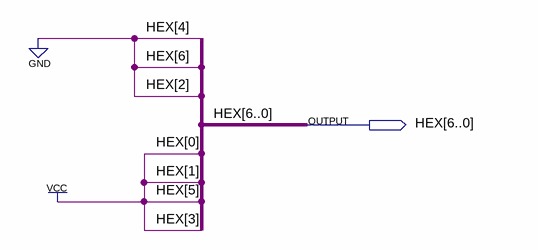
[diagram p0: schematic sheet]
// Quartus schematic No.bdf as structural Verilog: 0 symbols, 1 pins
module No (
  output [6:0] HEX
);


  assign HEX = 7'b0101011;
endmodule
